# Altium schematic sheet ProgramableResistor.SchDoc
size Letter; Author: Adam Gilbert; CompanyName: McGill University; DrawnBy: Adam Gilbert; Organization: Altium Limited; Address1: McGill Cosmology; Address2: 3600 University Street; Address3: Montreal, Quebec; Address4: Canada; DocumentNumber: 8; Revision: Rev2; SheetNumber: 8; SheetTotal: 16; ProjectTitle: DfMux FMC Mezz; ModelNumber: MGMEZZ04; ProjectName: DfMux FMC Mezz
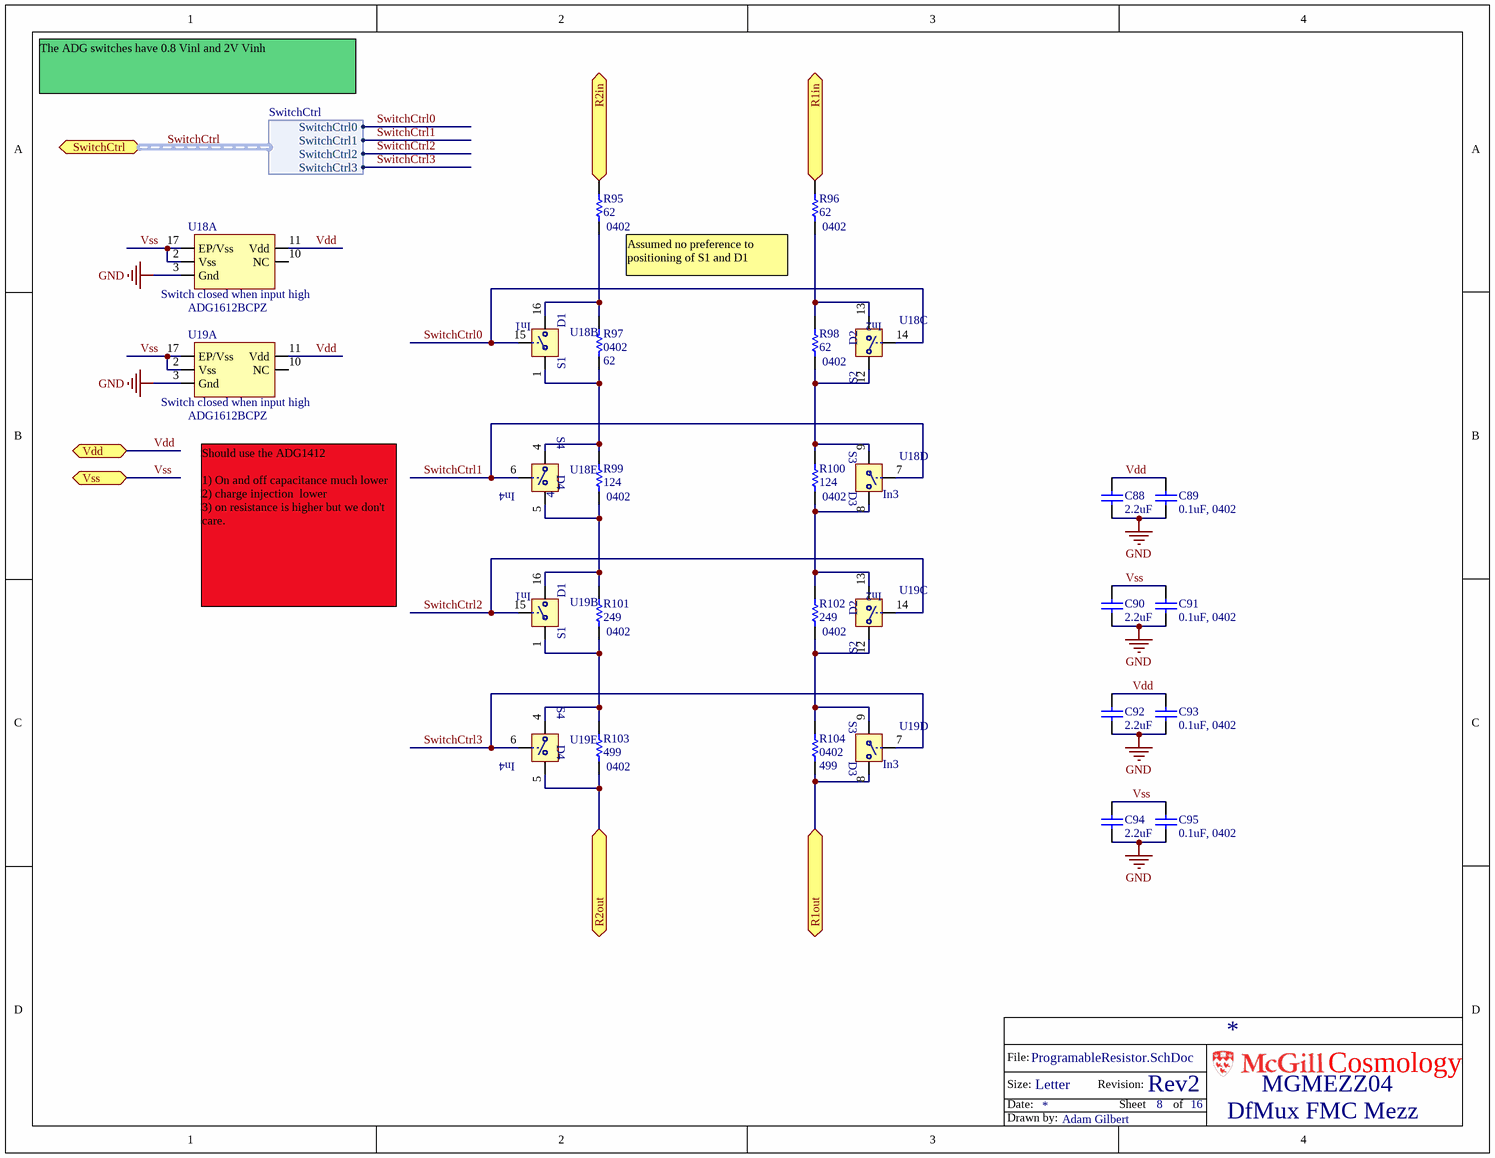
[diagram p0: ProgramableResistor.SchDoc]

## Parts
C88  2.2uF  [0603]
C89  0.1uF, 0402  [0402]
C90  2.2uF  [0603]
C91  0.1uF, 0402  [0402]
C92  2.2uF  [0603]
C93  0.1uF, 0402  [0402]
C94  2.2uF  [0603]
C95  0.1uF, 0402  [0402]
R95  62  [0402]
R96  62  [0402]
R97  62  [0402]
R98  62  [0402]
R99  124  [0402]
R100  124  [0402]
R101  249  [0402]
R102  249  [0402]
R103  499  [0402]
R104  499  [0402]
U18  ADG1612BCPZ  [QFN127P600-8N]  (parts A,B,C,D,E of 5)
U19  ADG1612BCPZ  [QFN127P600-8N]  (parts A,B,C,D,E of 5)

## Ports
R1in, R1out, R2in, R2out, SwitchCtrl (harness SwitchCtrl), Vdd, Vss

## Harnesses
SwitchCtrl: SwitchCtrl0, SwitchCtrl1, SwitchCtrl2, SwitchCtrl3

## Nets
GND: C88.2 C89.1 C90.2 C91.1 C92.2 C93.1 C94.2 C95.1 U18.3(Gnd) U19.3(Gnd)
R1in: R96.2 ; port R1in
R1out: R104.2 U19.8(D3) ; port R1out
R2in: R95.2 ; port R2in
R2out: R103.1 U19.5(D4) ; port R2out
SwitchCtrl0: U18.14(In2) U18.15(In1) ; port SwitchCtrl.SwitchCtrl0  [project net SwitchCtrl.SwitchCtrl0]
SwitchCtrl1: U18.6(In4) U18.7(In3) ; port SwitchCtrl.SwitchCtrl1  [project net SwitchCtrl.SwitchCtrl1]
SwitchCtrl2: U19.14(In2) U19.15(In1) ; port SwitchCtrl.SwitchCtrl2  [project net SwitchCtrl.SwitchCtrl2]
SwitchCtrl3: U19.6(In4) U19.7(In3) ; port SwitchCtrl.SwitchCtrl3  [project net SwitchCtrl.SwitchCtrl3]
Vdd: C88.1 C89.2 C92.1 C93.2 U18.11(Vdd) U19.11(Vdd) ; port Vdd
Vss: C90.1 C91.2 C94.1 C95.2 U18.2(Vss) U18.17(EP/Vss) U19.2(Vss) U19.17(EP/Vss) ; port Vss
NetR95_1: R95.1 R97.1 U18.16(D1)
NetR96_1: R96.1 R98.2 U18.13(D2)
NetR97_2: R97.2 R99.2 U18.1(S1) U18.4(S4)
NetR98_1: R98.1 R100.2 U18.9(S3) U18.12(S2)
NetR99_1: R99.1 R101.2 U18.5(D4) U19.16(D1)
NetR100_1: R100.1 R102.2 U18.8(D3) U19.13(D2)
NetR101_1: R101.1 R103.2 U19.1(S1) U19.4(S4)
NetR102_1: R102.1 R104.1 U19.9(S3) U19.12(S2)

Not connected (* = marked no-connect by the designer): U18 10(NC); U19 10(NC)

## Buses and harness runs
harness SwitchCtrl = port SwitchCtrl

## Notes on the sheet
- The ADG switches have 0.8 Vinl and 2V Vinh
- Assumed no preference to positioning of S1 and D1
- (near U18) 4
- Should use the ADG1412
  1) On and off capacitance much lower
  2) charge injection  lower
  3) on resistance is higher but we don't care.
- File:
- Size:
- Date:
- Letter
- Revision:
- Sheet
- of
- Cosmology
- Drawn by:
- (in symbol ADG1612BCPZ, part A) Switch closed when input high

## Library data of the parts
C88 C90 C92 C94 = CAP 0603: Capacitor, Ceramic, 0603; Part Constraints: 10% 6.3V X5R 0603; Manufacturer: TDK Corporation; Manufacturer Part Number 1: C1608X5R0J225K080AB; Assembly Comments: none; Temperature Coefficient: X5R; Value: 2.2uF; Supplier 1: Digi-Key; Supplier Part Number 1: 445-5175-1-ND; Operating Temperature: -55°C ~ 85°C; Thickness (Max): 0.037" (0.95mm); Packaging: Cut Tape (CT)
C89 C91 C93 C95 = CAP 0603: Capacitor, Ceramic, 0402; Part Constraints: 10% 10V X5R 0402; Manufacturer: TDK Corporation; Manufacturer Part Number 1: C1005X5R1A104K050BA; Temperature Coefficient: X5R; Assembly Comments: none; Value: 0.1uF, 0402; Supplier 1: Digi-Key; Supplier Part Number 1: 445-1265-1-ND; Operating Temperature: -55°C ~ 85°C; Thickness (Max): 0.022" (0.55mm); Packaging: Cut Tape (CT)
R95-R104 = RES 0402: Resistor; Manufacturer: Generic; Part Constraints: 1% 1/10W 100ppm 0402; Assembly Comments: none; Manufacturer Part Number 1: Generic
  R95-R98: Value: 62
  R99 R100: Value: 124
  R101 R102: Value: 249
  R103 R104: Value: 499
U18 U19 = ADG1612BCPZ: Switch 4 SPST-NO - VQFN package; Manufacturer Part Number 1: ADG1612BCPZ-REEL7; Manufacturer: Analog Devices Inc; Assembly Comments: none; Supplier 1: Digi-Key; Operating Temperature: -40°C ~ 125°C; Packaging: Cut Tape (CT); Supplier Part Number 1: ADG1612BCPZ-REEL7CT-ND; Part Constraints: ADG1612BCPZ-REEL7